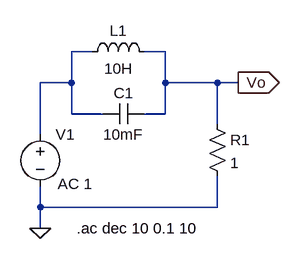
[diagram p0: schematic passive-filter-band-block.asc]
passive-filter-band-block.asc, the LTspice schematic file:
Version 4
SHEET 1 880 680
WIRE 96 32 64 32
WIRE 208 32 176 32
WIRE 64 80 64 32
WIRE 64 80 16 80
WIRE 208 80 208 32
WIRE 288 80 208 80
WIRE 320 80 288 80
WIRE 64 128 64 80
WIRE 112 128 64 128
WIRE 208 128 208 80
WIRE 208 128 176 128
WIRE 288 144 288 80
WIRE 16 160 16 80
WIRE 16 272 16 240
WIRE 288 272 288 224
WIRE 288 272 16 272
WIRE 16 304 16 272
FLAG 16 304 0
FLAG 320 80 Vo
IOPIN 320 80 Out
SYMBOL res 272 128 R0
SYMATTR InstName R1
SYMATTR Value 1
SYMBOL voltage 16 144 R0
WINDOW 123 27 92 Left 2
WINDOW 39 0 0 Left 2
SYMATTR Value2 AC 1
SYMATTR InstName V1
SYMATTR Value ""
SYMBOL ind 80 48 R270
WINDOW 0 32 56 VTop 2
WINDOW 3 5 56 VBottom 2
SYMATTR InstName L1
SYMATTR Value 10H
SYMBOL cap 112 144 R270
WINDOW 0 32 32 VTop 2
WINDOW 3 0 32 VBottom 2
SYMATTR InstName C1
SYMATTR Value 10mF
TEXT 72 304 Left 2 !.ac dec 10 0.1 10

The netlist it stands for:
* passive-filter-band-block.asc
R1 Vo 0 1
V1 N001 0 AC 1
L1 N001 Vo 10H
C1 N001 Vo 10mF
.ac dec 10 0.1 10
.backanno
.end